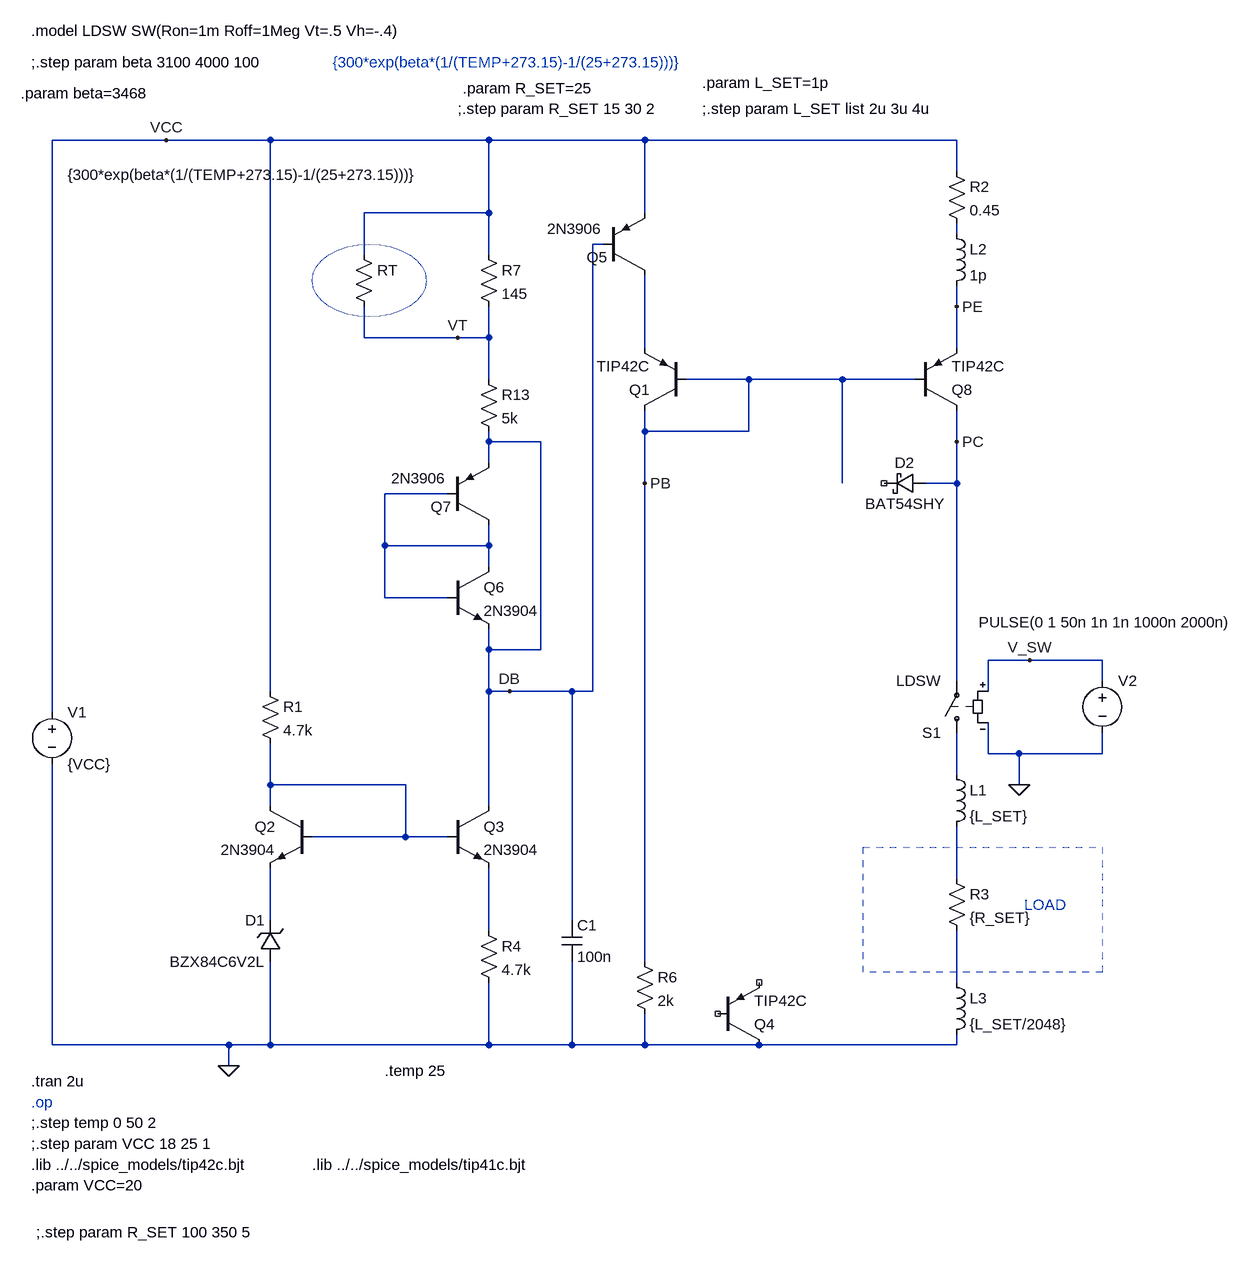
[diagram p0: schematic current_source4.asc]
current_source4.asc, the LTspice schematic file:
Version 4
SHEET 1 4220 1216
WIRE -528 -800 -704 -800
WIRE -368 -800 -528 -800
WIRE -32 -800 -368 -800
WIRE 208 -800 -32 -800
WIRE 688 -800 208 -800
WIRE 688 -752 688 -800
WIRE -32 -688 -32 -800
WIRE -32 -688 -224 -688
WIRE 208 -688 208 -800
WIRE 688 -656 688 -672
WIRE 144 -640 128 -640
WIRE -224 -624 -224 -688
WIRE -32 -624 -32 -688
WIRE 688 -544 688 -576
WIRE -224 -496 -224 -544
WIRE -80 -496 -224 -496
WIRE -32 -496 -32 -544
WIRE -32 -496 -80 -496
WIRE 208 -480 208 -592
WIRE 688 -480 688 -544
WIRE -32 -432 -32 -496
WIRE 368 -432 272 -432
WIRE 512 -432 368 -432
WIRE 624 -432 512 -432
WIRE 208 -352 208 -384
WIRE 368 -352 368 -432
WIRE 368 -352 208 -352
WIRE -32 -336 -32 -352
WIRE 48 -336 -32 -336
WIRE 688 -336 688 -384
WIRE -32 -304 -32 -336
WIRE 208 -272 208 -352
WIRE 512 -272 512 -432
WIRE 688 -272 688 -336
WIRE 688 -272 640 -272
WIRE -96 -256 -192 -256
WIRE -192 -176 -192 -256
WIRE -32 -176 -32 -208
WIRE -32 -176 -192 -176
WIRE -32 -144 -32 -176
WIRE -192 -96 -192 -176
WIRE -96 -96 -192 -96
WIRE -32 -16 -32 -48
WIRE 48 -16 48 -336
WIRE 48 -16 -32 -16
WIRE 800 0 736 0
WIRE 912 0 800 0
WIRE 688 32 688 -272
WIRE 912 32 912 0
WIRE -368 48 -368 -800
WIRE -32 48 -32 -16
WIRE 0 48 -32 48
WIRE 96 48 0 48
WIRE 128 48 128 -640
WIRE 128 48 96 48
WIRE 736 48 736 0
WIRE -704 80 -704 -800
WIRE 736 144 736 96
WIRE 784 144 736 144
WIRE 912 144 912 112
WIRE 912 144 784 144
WIRE 688 176 688 112
WIRE -368 192 -368 128
WIRE -160 192 -368 192
WIRE 784 192 784 144
WIRE -368 224 -368 192
WIRE -32 224 -32 48
WIRE -160 272 -160 192
WIRE -160 272 -304 272
WIRE -96 272 -160 272
WIRE 688 336 688 256
WIRE -368 400 -368 320
WIRE 96 400 96 48
WIRE -32 416 -32 320
WIRE 208 464 208 -272
WIRE 688 496 688 416
WIRE -704 592 -704 160
WIRE -432 592 -704 592
WIRE -368 592 -368 464
WIRE -368 592 -432 592
WIRE -32 592 -32 496
WIRE -32 592 -368 592
WIRE 96 592 96 464
WIRE 96 592 -32 592
WIRE 208 592 208 544
WIRE 208 592 96 592
WIRE 384 592 208 592
WIRE 688 592 688 576
WIRE 688 592 384 592
WIRE -432 624 -432 592
FLAG -432 624 0
FLAG 688 -544 PE
FLAG 688 -336 PC
FLAG -80 -496 VT
FLAG -528 -800 VCC
FLAG 208 -272 PB
FLAG 0 48 DB
FLAG 784 192 0
FLAG 800 0 V_SW
SYMBOL npn -304 224 M0
SYMATTR InstName Q2
SYMATTR Value 2N3904
SYMBOL zener -352 464 R180
WINDOW 0 24 64 Left 2
WINDOW 3 24 0 Left 2
SYMATTR InstName D1
SYMATTR Value BZX84C6V2L
SYMBOL res -384 32 R0
SYMATTR InstName R1
SYMATTR Value 4.7k
SYMBOL res 672 -768 R0
SYMATTR InstName R2
SYMATTR Value 0.45
SYMBOL res 672 320 R0
SYMATTR InstName R3
SYMATTR Value {R_SET}
SYMBOL voltage -704 64 R0
SYMATTR InstName V1
SYMATTR Value {VCC}
SYMBOL npn -96 224 R0
SYMATTR InstName Q3
SYMATTR Value 2N3904
SYMBOL res -48 400 R0
SYMATTR InstName R4
SYMATTR Value 4.7k
SYMBOL pnp 320 592 M180
SYMATTR InstName Q4
SYMATTR Value TIP42C
SYMBOL pnp -96 -208 M180
WINDOW 0 -25 28 Left 2
WINDOW 3 -86 72 Left 2
SYMATTR InstName Q7
SYMATTR Value 2N3906
SYMBOL npn -96 -144 R0
SYMATTR InstName Q6
SYMATTR Value 2N3904
SYMBOL res -48 -640 R0
SYMATTR InstName R7
SYMATTR Value 145
SYMBOL res -48 -448 R0
SYMATTR InstName R13
SYMATTR Value 5k
SYMBOL res -240 -640 R0
WINDOW 3 -440 -107 Left 2
SYMATTR Value {300*exp(beta*(1/(TEMP+273.15)-1/(25+273.15)))}
SYMATTR InstName RT
SYMBOL pnp 272 -384 R180
SYMATTR InstName Q1
SYMATTR Value TIP42C
SYMBOL sw 688 128 R180
SYMATTR InstName S1
SYMATTR Value LDSW
SYMBOL voltage 912 16 R0
WINDOW 123 0 0 Left 0
WINDOW 39 0 0 Left 0
WINDOW 3 -190 -74 Left 2
SYMATTR Value PULSE(0 1 50n 1n 1n 1000n 2000n)
SYMATTR InstName V2
SYMBOL schottky 640 -288 R90
WINDOW 0 0 32 VBottom 2
WINDOW 3 32 32 VTop 2
SYMATTR InstName D2
SYMATTR Value BAT54SHY
SYMATTR Description Diode
SYMATTR Type diode
SYMBOL ind 672 160 R0
SYMATTR InstName L1
SYMATTR Value {L_SET}
SYMBOL ind 672 -672 R0
SYMATTR InstName L2
SYMATTR Value 1p
SYMBOL ind 672 480 R0
SYMATTR InstName L3
SYMATTR Value {L_SET/2048}
SYMBOL cap 80 400 R0
SYMATTR InstName C1
SYMATTR Value 100n
SYMBOL pnp 624 -384 M180
SYMATTR InstName Q8
SYMATTR Value TIP42C
SYMBOL res 192 448 R0
SYMATTR InstName R6
SYMATTR Value 2k
SYMBOL pnp 144 -592 M180
WINDOW 0 -25 28 Left 2
WINDOW 3 -86 72 Left 2
SYMATTR InstName Q5
SYMATTR Value 2N3906
TEXT -736 648 Left 2 !.tran 2u
TEXT -736 712 Left 2 !;.step temp 0 50 2
TEXT 792 376 Left 2 ;LOAD
TEXT -736 680 Left 2 ;.op
TEXT -72 -880 Left 2 !.param R_SET=25
TEXT -736 744 Left 2 !;.step param VCC 18 25 1
TEXT -736 776 Left 2 !.lib ../../spice_models/tip42c.bjt
TEXT -736 808 Left 2 !.param VCC=20
TEXT -728 880 Left 2 !;.step param R_SET 100 350 5
TEXT -752 -872 Left 2 !.param beta=3468
TEXT -736 -920 Left 2 !;.step param beta 3100 4000 100
TEXT -272 -920 Left 2 ;{300*exp(beta*(1/(TEMP+273.15)-1/(25+273.15)))}
TEXT -80 -848 Left 2 !;.step param R_SET 15 30 2
TEXT -736 -968 Left 2 !.model LDSW SW(Ron=1m Roff=1Meg Vt=.5 Vh=-.4)
TEXT -192 632 Left 2 !.temp 25
TEXT 296 -848 Left 2 !;.step param L_SET list 2u 3u 4u
TEXT -304 776 Left 2 !.lib ../../spice_models/tip41c.bjt
TEXT 296 -888 Left 2 !.param L_SET=1p
RECTANGLE Normal 912 480 544 288 2
CIRCLE Normal -128 -528 -304 -640 2

The netlist it stands for:
* current_source4.asc
Q2 N005 N005 N007 0 2N3904
D1 0 N007 BZX84C6V2L
R1 VCC N005 4.7k
R2 VCC N001 0.45
R3 N006 N009 {R_SET}
V1 VCC 0 {VCC}
Q3 DB N005 N008 0 2N3904
R4 N008 0 4.7k
Q4 0 NC_01 NC_02 0 TIP42C
Q7 N003 N003 DB 0 2N3906
Q6 N003 N003 DB 0 2N3904
R7 VCC VT 145
R13 VT DB 5k
RT VCC VT {300*exp(beta*(1/(TEMP+273.15)-1/(25+273.15)))}
Q1 PB PB N002 0 TIP42C
S1 N004 PC V_SW 0 LDSW
V2 V_SW 0 PULSE(0 1 50n 1n 1n 1000n 2000n)
D2 PC NC_03 BAT54SHY
L1 N004 N006 {L_SET}
L2 N001 PE 1p
L3 N009 0 {L_SET/2048}
C1 DB 0 100n
Q8 PC PB PE 0 TIP42C
R6 PB 0 2k
Q5 N002 DB VCC 0 2N3906
.model D D
.lib standard.dio
.model NPN NPN
.model PNP PNP
.lib standard.bjt
.tran 2u
;.step temp 0 50 2
* LOAD
* .op
.param R_SET=25
;.step param VCC 18 25 1
.lib ../../spice_models/tip42c.bjt
.param VCC=20
;.step param R_SET 100 350 5
.param beta=3468
;.step param beta 3100 4000 100
* {300*exp(beta*(1/(TEMP+273.15)-1/(25+273.15)))}
;.step param R_SET 15 30 2
.model LDSW SW(Ron=1m Roff=1Meg Vt=.5 Vh=-.4)
.temp 25
;.step param L_SET list 2u 3u 4u
.lib ../../spice_models/tip41c.bjt
.param L_SET=1p
.backanno
.end